# Altium schematic sheet MCU.SchDoc
size A4
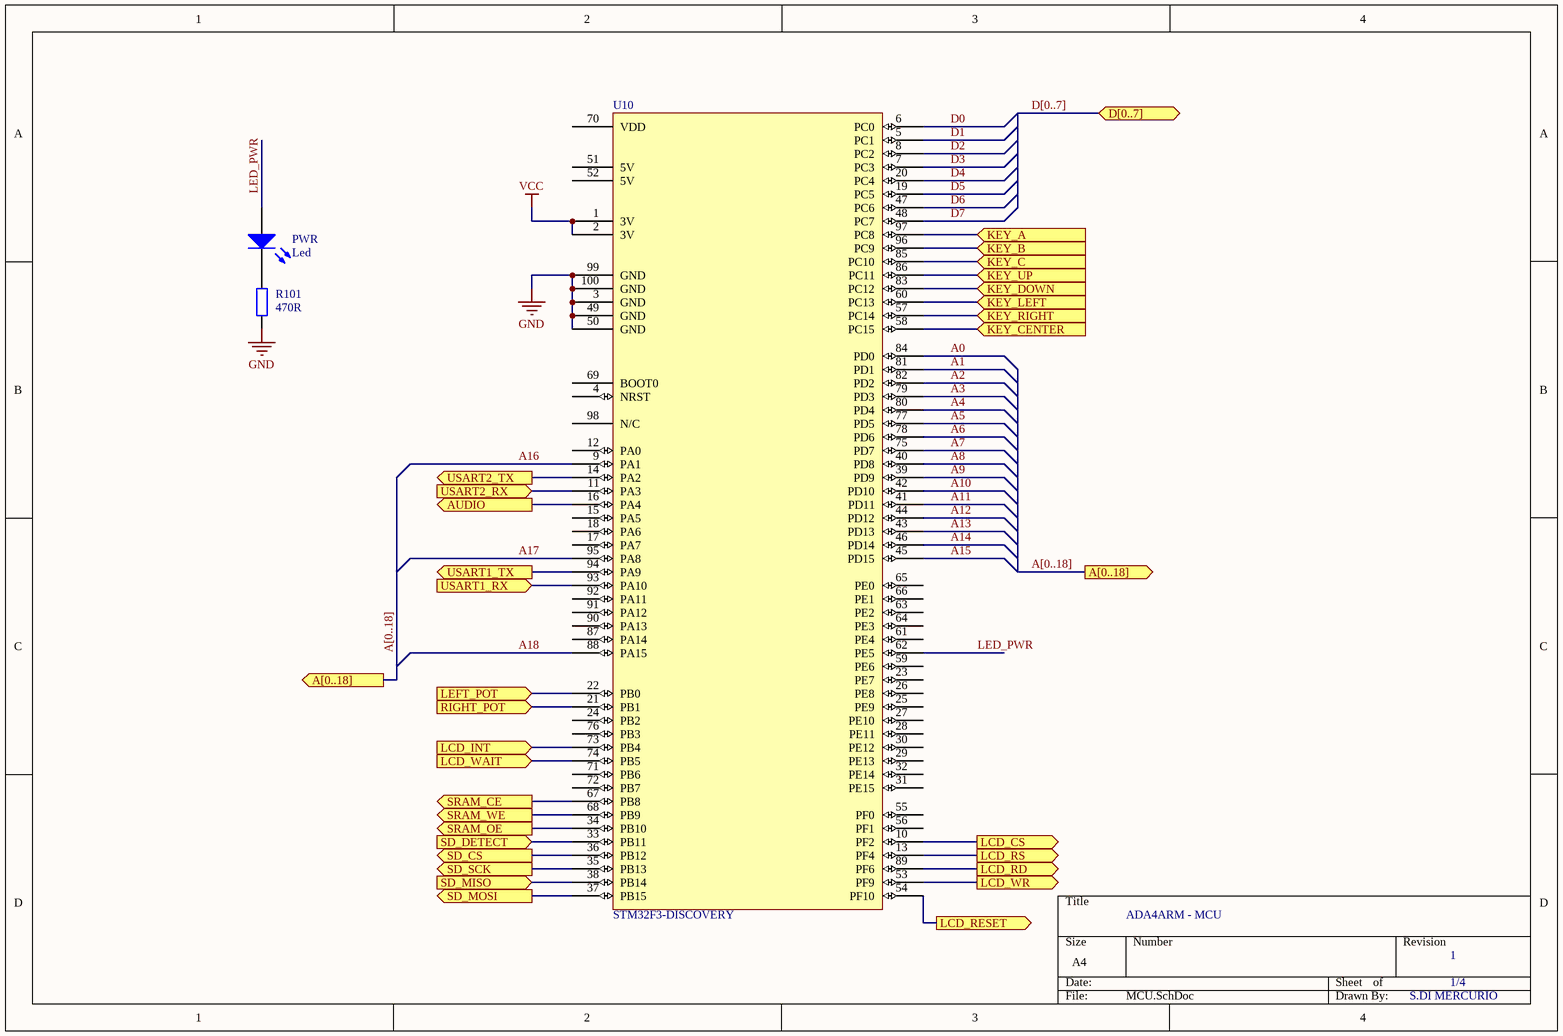
[diagram p0: MCU.SchDoc]

## Parts
PWR  Led  [OSRAM LO Q971]
R101  value 470R  [RESC3216N]  (hidden comment: Res_EU)
U10  STM32F3-DISCOVERY  [STM32F3-DISCOVERY]

## Ports
A[0..18] (out), AUDIO (out), D[0..7] (bidir), KEY_A (in), KEY_B (in), KEY_C (in), KEY_CENTER (in), KEY_DOWN (in), KEY_LEFT (in), KEY_RIGHT (in), KEY_UP (in), LCD_CS (out), LCD_INT (in), LCD_RD (out), LCD_RESET (out), LCD_RS (out), LCD_WAIT (in), LCD_WR (out), LEFT_POT (in), RIGHT_POT (in), SD_CS (out), SD_DETECT (in), SD_MISO (in), SD_MOSI (out), SD_SCK (out), SRAM_CE (out), SRAM_OE (out), SRAM_WE (out), USART1_RX (in), USART1_TX (out), USART2_RX (in), USART2_TX (out)

## Nets
GND: R101.1 U10.3(GND) U10.49(GND) U10.50(GND) U10.99(GND) U10.100(GND)
VCC: U10.1(3V) U10.2(3V)
A0: U10.84(PD0)
A1: U10.81(PD1)
A2: U10.82(PD2)
A3: U10.79(PD3)
A4: U10.80(PD4)
A5: U10.77(PD5)
A6: U10.78(PD6)
A7: U10.75(PD7)
A8: U10.40(PD8)
A9: U10.39(PD9)
A10: U10.42(PD10)
A11: U10.41(PD11)
A12: U10.44(PD12)
A13: U10.43(PD13)
A14: U10.46(PD14)
A15: U10.45(PD15)
A16: U10.9(PA1)
A17: U10.95(PA8)
A18: U10.88(PA15)
AUDIO: U10.16(PA4) ; port AUDIO
D0: U10.6(PC0)
D1: U10.5(PC1)
D2: U10.8(PC2)
D3: U10.7(PC3)
D4: U10.20(PC4)
D5: U10.19(PC5)
D6: U10.47(PC6)
D7: U10.48(PC7)
KEY_A: U10.97(PC8) ; port KEY_A
KEY_B: U10.96(PC9) ; port KEY_B
KEY_C: U10.85(PC10) ; port KEY_C
KEY_CENTER: U10.58(PC15) ; port KEY_CENTER
KEY_DOWN: U10.83(PC12) ; port KEY_DOWN
KEY_LEFT: U10.60(PC13) ; port KEY_LEFT
KEY_RIGHT: U10.57(PC14) ; port KEY_RIGHT
KEY_UP: U10.86(PC11) ; port KEY_UP
LCD_CS: U10.10(PF2) ; port LCD_CS
LCD_INT: U10.73(PB4) ; port LCD_INT
LCD_RD: U10.89(PF6) ; port LCD_RD
LCD_RESET: U10.54(PF10) ; port LCD_RESET
LCD_RS: U10.13(PF4) ; port LCD_RS
LCD_WAIT: U10.74(PB5) ; port LCD_WAIT
LCD_WR: U10.53(PF9) ; port LCD_WR
LED_PWR: PWR.A U10.62(PE5)
LEFT_POT: U10.22(PB0) ; port LEFT_POT
RIGHT_POT: U10.21(PB1) ; port RIGHT_POT
SD_CS: U10.36(PB12) ; port SD_CS
SD_DETECT: U10.33(PB11) ; port SD_DETECT
SD_MISO: U10.38(PB14) ; port SD_MISO
SD_MOSI: U10.37(PB15) ; port SD_MOSI
SD_SCK: U10.35(PB13) ; port SD_SCK
SRAM_CE: U10.67(PB8) ; port SRAM_CE
SRAM_OE: U10.34(PB10) ; port SRAM_OE
SRAM_WE: U10.68(PB9) ; port SRAM_WE
USART1_RX: U10.93(PA10) ; port USART1_RX
USART1_TX: U10.94(PA9) ; port USART1_TX
USART2_RX: U10.11(PA3) ; port USART2_RX
USART2_TX: U10.14(PA2) ; port USART2_TX
NetPWR_K: PWR.K R101.2

Not connected (* = marked no-connect by the designer): U10 4(NRST) 12(PA0) 15(PA5) 17(PA7) 18(PA6) 23(PE7) 24(PB2) 25(PE9) 26(PE8) 27(PE10) 28(PE11) 29(PE13) 30(PE12) 31(PE15) 32(PE14) 51(5V) 52(5V) 55(PF0) 56(PF1) 59(PE6) 61(PE4) 63(PE2) 64(PE3) 65(PE0) 66(PE1) 69(BOOT0) 70(VDD) 71(PB6) 72(PB7) 76(PB3) 87(PA14) 90(PA13) 91(PA12) 92(PA11) 98(N/C)

## Buses and harness runs
bus A[0..18] = port A[0..18]
bus D[0..7] = port D[0..7]

## Notes on the sheet
- ADA4ARM - MCU
- 1
- 1/4
- S.DI MERCURIO

## Library data of the parts
R101 = Res_EU: Resistor; Published: 8-Jun-2000; LatestRevisionDate: 17-Jul-2002; LatestRevisionNote: Re-released for DXP Platform.; PackageReference: AXIAL-0.4; Publisher: Altium Limited